# Altium project NFC-Reader.PrjPcb (part 5 of 11)
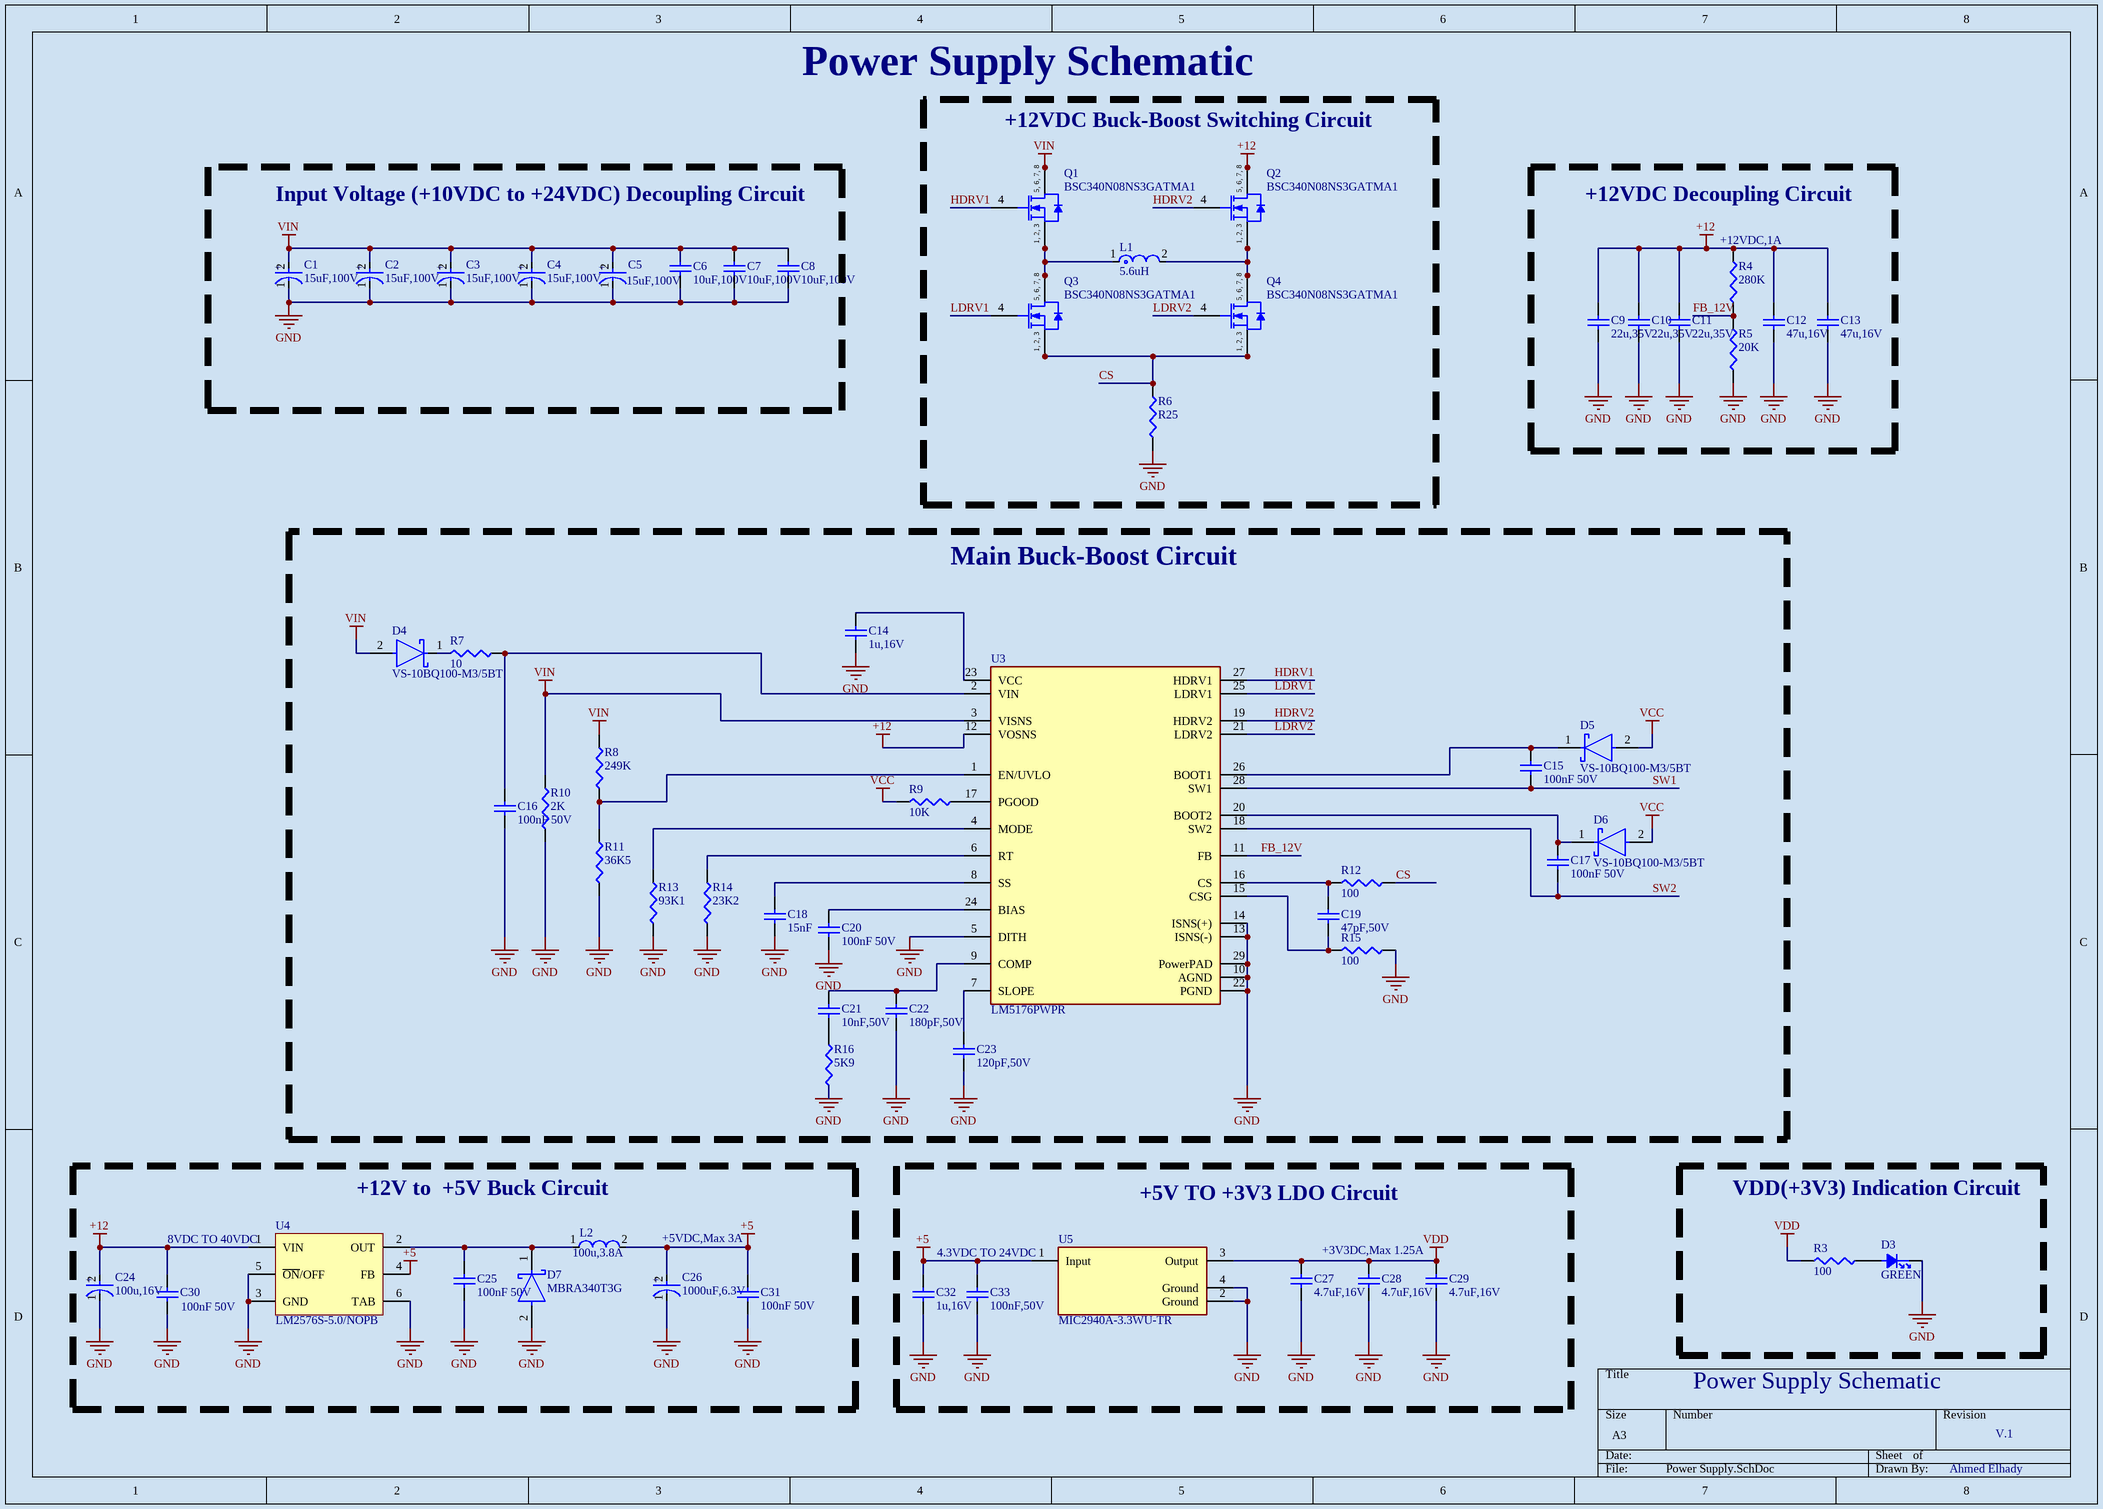
[diagram p8: Power Supply.SchDoc]

## Sheet Power Supply.SchDoc (continued)

### Library data of the parts (continued)
R14 = CRCW040223K2FKED: 23.2 kOhms ±1% 0.063W, 1/16W Chip Resistor 0402 (1005 Metric) Automotive AEC-Q200 Thick Film; Manufacturer: Vishay; Max Power Dissipation: 63mW; Value: 23.2kΩ; Temperature Coefficient: 100ppm/°C; Voltage Rating: 50V; Supplier: DigiKey; Manufacturer Part Number: CRCW040223K2FKED; RoHS: Compliant; Category: Chip SMD Resistors; Stock: 48935; Pricing: 1=0.1, 10=0.03, 25=0.0224, 50=0.018, 100=0.0148, 250=0.01156, 500=0.00974, 1000=0.00832, 5000=0.00637, 10000=0.00438, 20000=0.00433, 30000=0.0043, 50000=0.00427, 70000=0.00425, 100000=0.00414, 120000=0.00407, 240000=0.00384, 250000=0.00383 (USD); Case/Package: 0402; Case Code (Imperial): 0402; China RoHS: Non-Compliant; Composition: Thick Film; Contact Plating: Tin; Depth: 500µm; Features: Automotive AEC-Q200; Height: 350µm; Lead Free: Lead Free; Length: 1mm; Lifecycle Status: Production; Max Operating Temperature: 155°C; Military Standard: Not; Min Operating Temperature: -55°C; Mounting Technology: Surface Mount; Pins: 2; Number of Terminals: 2; Number of Terminations: 2; Packaging: Cut Tape; Power Dissipation: 63mW; Power Rating: 63mW; Radiation Hardening: No; REACH SVHC: Yes; Schedule B: 8533210045; Termination: SMD/SMT; Tolerance: 1%; Voltage Rating (DC): 50V; Weight: 652.039032µg; Width: 500µm; Working Voltage: 50V; ComponentLink1URL: https://datasheet.octopart.com:443/CRCW040223K2FKED-Vishay-datasheet-175423584.pdf?src-supplier=IHS; ComponentLink1Description: https://datasheet.octopart.com:443/CRCW040223K2FKED-Vishay-datasheet-175423584.pdf?src-supplier=IHS; ComponentLink2URL: https://datasheet.octopart.com:443/CRCW040223K2FKED-Vishay-datasheet-190005712.pdf?src-supplier=TME; ComponentLink2Description: https://datasheet.octopart.com:443/CRCW040223K2FKED-Vishay-datasheet-190005712.pdf?src-supplier=TME; ComponentLink3URL: https://datasheet.octopart.com:443/CRCW040223K2FKED.-Vishay-datasheet-83961561.pdf?src-supplier=element14+APAC; ComponentLink3Description: https://datasheet.octopart.com:443/CRCW040223K2FKED.-Vishay-datasheet-83961561.pdf?src-supplier=element14+APAC; ComponentLink4URL: https://datasheet.octopart.com:443/CRCW040223K2FKED-Vishay-datasheet-66077789.pdf?src-supplier=element14+APAC; ComponentLink4Description: https://datasheet.octopart.com:443/CRCW040223K2FKED-Vishay-datasheet-66077789.pdf?src-supplier=element14+APAC; ComponentLink5URL: https://datasheet.octopart.com:443/CRCW040223K2FKED-Vishay-datasheet-62317933.pdf?src-supplier=element14+APAC; ComponentLink5Description: https://datasheet.octopart.com:443/CRCW040223K2FKED-Vishay-datasheet-62317933.pdf?src-supplier=element14+APAC; ComponentLink6URL: https://datasheet.octopart.com:443/CRCW040223K2FKED-Vishay-datasheet-14722531.pdf?src-supplier=element14+APAC; ComponentLink6Description: https://datasheet.octopart.com:443/CRCW040223K2FKED-Vishay-datasheet-14722531.pdf?src-supplier=element14+APAC; ComponentLink7URL: https://datasheet.octopart.com:443/CRCW040223K2FKED.-Vishay-datasheet-78776209.pdf?src-supplier=Newark; ComponentLink7Description: https://datasheet.octopart.com:443/CRCW040223K2FKED.-Vishay-datasheet-78776209.pdf?src-supplier=Newark; ComponentLink8URL: https://datasheet.octopart.com:443/CRCW040223K2FKED-Vishay-datasheet-11761042.pdf?src-supplier=Newark; ComponentLink8Description: https://datasheet.octopart.com:443/CRCW040223K2FKED-Vishay-datasheet-11761042.pdf?src-supplier=Newark; ComponentLink9URL: https://datasheet.octopart.com:443/CRCW040223K2FKED-Vishay-datasheet-159614168.pdf?src-supplier=Newark; ComponentLink9Description: https://datasheet.octopart.com:443/CRCW040223K2FKED-Vishay-datasheet-159614168.pdf?src-supplier=Newark; ComponentLink10URL: https://datasheet.octopart.com:443/CRCW040223K2FKED-Vishay-datasheet-33013972.pdf?src-supplier=Newark; ComponentLink10Description: https://datasheet.octopart.com:443/CRCW040223K2FKED-Vishay-datasheet-33013972.pdf?src-supplier=Newark; ComponentLink11URL: https://datasheet.octopart.com:443/CRCW040223K2FKED-Vishay-datasheet-21268114.pdf?src-supplier=Newark; ComponentLink11Description: https://datasheet.octopart.com:443/CRCW040223K2FKED-Vishay-datasheet-21268114.pdf?src-supplier=Newark; ComponentLink12URL: https://datasheet.octopart.com:443/CRCW040223K2FKED-Vishay-datasheet-21226360.pdf?src-supplier=Newark; ComponentLink12Description: https://datasheet.octopart.com:443/CRCW040223K2FKED-Vishay-datasheet-21226360.pdf?src-supplier=Newark; ComponentLink13URL: https://datasheet.octopart.com:443/CRCW040223K2FKED-Vishay-datasheet-62316122.pdf?src-supplier=Future+Electronics; ComponentLink13Description: https://datasheet.octopart.com:443/CRCW040223K2FKED-Vishay-datasheet-62316122.pdf?src-supplier=Future+Electronics; ComponentLink14URL: https://datasheet.octopart.com:443/CRCW040223K2FKED-Vishay-datasheet-12509741.pdf?src-supplier=Future+Electronics; ComponentLink14Description: https://datasheet.octopart.com:443/CRCW040223K2FKED-Vishay-datasheet-12509741.pdf?src-supplier=Future+Electronics; ComponentLink15URL: https://datasheet.octopart.com:443/CRCW040223K2FKED-Vishay-Dale-datasheet-47688880.pdf?src-supplier=RS+(Formerly+Allied+Electronics); ComponentLink15Description: https://datasheet.octopart.com:443/CRCW040223K2FKED-Vishay-Dale-datasheet-47688880.pdf?src-supplier=RS+(Formerly+Allied+Electronics); ComponentLink16URL: https://datasheet.octopart.com:443/CRCW040223K2FKED-Vishay-datasheet-12001583.pdf?src-supplier=RS+(Formerly+Allied+Electronics); ComponentLink16Description: https://datasheet.octopart.com:443/CRCW040223K2FKED-Vishay-datasheet-12001583.pdf?src-supplier=RS+(Formerly+Allied+Electronics); ComponentLink17URL: https://datasheet.octopart.com:443/CRCW040223K2FKED-Vishay-datasheet-5306405.pdf?src-supplier=RS+(Formerly+Allied+Electronics); ComponentLink17Description: https://datasheet.octopart.com:443/CRCW040223K2FKED-Vishay-datasheet-5306405.pdf?src-supplier=RS+(Formerly+Allied+Electronics); ComponentLink18URL: https://datasheet.octopart.com/D-CRCW-e3-Standard-Thick-Film-Chip-Resistors-Vishay-datasheet-family-64.pdf; ComponentLink18Description: https://datasheet.octopart.com/D-CRCW-e3-Standard-Thick-Film-Chip-Resistors-Vishay-datasheet-family-64.pdf; ComponentLink19URL: https://datasheet.octopart.com:443/CRCW040223K2FKED-Vishay-datasheet-11516975.pdf?src-supplier=Farnell; ComponentLink19Description: https://datasheet.octopart.com:443/CRCW040223K2FKED-Vishay-datasheet-11516975.pdf?src-supplier=Farnell; ComponentLink20URL: https://datasheet.octopart.com:443/CRCW040223K2FKED-Vishay-datasheet-512477.pdf?src-supplier=Farnell; ComponentLink20Description: https://datasheet.octopart.com:443/CRCW040223K2FKED-Vishay-datasheet-512477.pdf?src-supplier=Farnell; ComponentLink21URL: https://datasheet.octopart.com:443/CRCW040223K2FKED-Vishay-datasheet-11540273.pdf?src-supplier=Arrow+Electronics; ComponentLink21Description: https://datasheet.octopart.com:443/CRCW040223K2FKED-Vishay-datasheet-11540273.pdf?src-supplier=Arrow+Electronics; ComponentLink22URL: https://datasheet.octopart.com:443/CRCW040223K2FKED-Vishay-datasheet-8445837.pdf?src-supplier=element14; ComponentLink22Description: https://datasheet.octopart.com:443/CRCW040223K2FKED-Vishay-datasheet-8445837.pdf?src-supplier=element14; ComponentLink23URL: https://datasheet.octopart.com:443/CRCW040223K2FKED-Vishay-datasheet-5377255.pdf?src-supplier=Garrett; ComponentLink23Description: https://datasheet.octopart.com:443/CRCW040223K2FKED-Vishay-datasheet-5377255.pdf?src-supplier=Garrett; ComponentLink24URL: https://datasheet.octopart.com:443/CRCW040223K2FKED-Vishay-datasheet-148188.pdf?src-supplier=Garrett; ComponentLink24Description: https://datasheet.octopart.com:443/CRCW040223K2FKED-Vishay-datasheet-148188.pdf?src-supplier=Garrett; ComponentLink25URL: https://datasheet.octopart.com:443/CRCW040223K2FKED-Vishay-datasheet-42367.pdf?src-supplier=Garrett; ComponentLink25Description: https://datasheet.octopart.com:443/CRCW040223K2FKED-Vishay-datasheet-42367.pdf?src-supplier=Garrett; ComponentLink26URL: http://sigma.octopart.com:80/rohs_certificate/D-CRCW-e3-Standard-Thick-Film-Chip-Resistors-Vishay-family-102.pdf?src-supplier=Compliance+Statements; ComponentLink26Description: http://sigma.octopart.com:80/rohs_certificate/D-CRCW-e3-Standard-Thick-Film-Chip-Resistors-Vishay-family-102.pdf?src-supplier=Compliance+Statements; LCSC PN: C2076557
R16 = CRCW04025K90FKED: 5.9 kOhms ±1% 0.063W, 1/16W Chip Resistor 0402 (1005 Metric) Automotive AEC-Q200 Thick Film; Manufacturer: Vishay; Max Power Dissipation: 63mW; Value: 5.9kΩ; Temperature Coefficient: 100ppm/°C; Voltage Rating: 50V; Supplier: DigiKey; Manufacturer Part Number: CRCW04025K90FKED; RoHS: Compliant; Category: Chip SMD Resistors; Stock: 139555; Pricing: 1=0.1, 10=0.03, 25=0.0224, 50=0.018, 100=0.0148, 250=0.01156, 500=0.00974, 1000=0.00832, 5000=0.00637 (USD); Case/Package: 0402; Case Code (Imperial): 0402; China RoHS: Non-Compliant; Composition: Thick Film; Contact Plating: Tin; Depth: 500µm; Features: Automotive AEC-Q200; Height: 350µm; Lead Free: Lead Free; Length: 1mm; Lifecycle Status: Production; Max Operating Temperature: 155°C; Military Standard: Not; Min Operating Temperature: -55°C; Mounting Technology: Surface Mount; Pins: 2; Number of Terminals: 2; Number of Terminations: 2; Packaging: Cut Tape; Power Dissipation: 63mW; Power Rating: 63mW; Radiation Hardening: No; REACH SVHC: Yes; Schedule B: 8533210045; Termination: SMD/SMT; Tolerance: 1%; Voltage Rating (DC): 50V; Weight: 652.039032µg; Width: 500µm; Working Voltage: 50V; ComponentLink1URL: https://datasheet.octopart.com:443/CRCW04025K90FKED-Vishay-datasheet-175423584.pdf?src-supplier=IHS; ComponentLink1Description: https://datasheet.octopart.com:443/CRCW04025K90FKED-Vishay-datasheet-175423584.pdf?src-supplier=IHS; ComponentLink2URL: https://datasheet.octopart.com:443/CRCW04025K90FKED-Vishay-datasheet-190005712.pdf?src-supplier=TME; ComponentLink2Description: https://datasheet.octopart.com:443/CRCW04025K90FKED-Vishay-datasheet-190005712.pdf?src-supplier=TME; ComponentLink3URL: https://datasheet.octopart.com:443/CRCW04025K90FKED-Vishay-datasheet-66077789.pdf?src-supplier=Newark; ComponentLink3Description: https://datasheet.octopart.com:443/CRCW04025K90FKED-Vishay-datasheet-66077789.pdf?src-supplier=Newark; ComponentLink4URL: https://datasheet.octopart.com:443/CRCW04025K90FKED-Vishay-datasheet-11761042.pdf?src-supplier=Newark; ComponentLink4Description: https://datasheet.octopart.com:443/CRCW04025K90FKED-Vishay-datasheet-11761042.pdf?src-supplier=Newark; ComponentLink5URL: https://datasheet.octopart.com:443/CRCW04025K90FKED-Vishay-datasheet-41302739.pdf?src-supplier=Newark; ComponentLink5Description: https://datasheet.octopart.com:443/CRCW04025K90FKED-Vishay-datasheet-41302739.pdf?src-supplier=Newark; ComponentLink6URL: https://datasheet.octopart.com:443/CRCW04025K90FKED-Vishay-datasheet-33013972.pdf?src-supplier=Newark; ComponentLink6Description: https://datasheet.octopart.com:443/CRCW04025K90FKED-Vishay-datasheet-33013972.pdf?src-supplier=Newark; ComponentLink7URL: https://datasheet.octopart.com:443/CRCW04025K90FKED-Vishay-datasheet-21226360.pdf?src-supplier=Newark; ComponentLink7Description: https://datasheet.octopart.com:443/CRCW04025K90FKED-Vishay-datasheet-21226360.pdf?src-supplier=Newark; ComponentLink8URL: https://datasheet.octopart.com:443/CRCW04025K90FKED-Vishay-datasheet-62317933.pdf?src-supplier=Farnell; ComponentLink8Description: https://datasheet.octopart.com:443/CRCW04025K90FKED-Vishay-datasheet-62317933.pdf?src-supplier=Farnell; ComponentLink9URL: https://datasheet.octopart.com:443/CRCW04025K90FKED.-Vishay-datasheet-83961561.pdf?src-supplier=Farnell; ComponentLink9Description: https://datasheet.octopart.com:443/CRCW04025K90FKED.-Vishay-datasheet-83961561.pdf?src-supplier=Farnell; ComponentLink10URL: https://datasheet.octopart.com:443/CRCW04025K90FKED-Vishay-datasheet-11516975.pdf?src-supplier=Farnell; ComponentLink10Description: https://datasheet.octopart.com:443/CRCW04025K90FKED-Vishay-datasheet-11516975.pdf?src-supplier=Farnell; ComponentLink11URL: https://datasheet.octopart.com:443/CRCW04025K90FKED-Vishay-datasheet-14722531.pdf?src-supplier=element14+APAC; ComponentLink11Description: https://datasheet.octopart.com:443/CRCW04025K90FKED-Vishay-datasheet-14722531.pdf?src-supplier=element14+APAC; ComponentLink12URL: https://datasheet.octopart.com:443/CRCW04025K90FKED-Vishay-datasheet-5299586.pdf?src-supplier=element14+APAC; ComponentLink12Description: https://datasheet.octopart.com:443/CRCW04025K90FKED-Vishay-datasheet-5299586.pdf?src-supplier=element14+APAC; ComponentLink13URL: https://datasheet.octopart.com:443/CRCW04025K90FKED-Vishay-datasheet-10380026.pdf?src-supplier=element14+APAC; ComponentLink13Description: https://datasheet.octopart.com:443/CRCW04025K90FKED-Vishay-datasheet-10380026.pdf?src-supplier=element14+APAC; ComponentLink14URL: https://datasheet.octopart.com:443/CRCW04025K90FKED-Vishay-datasheet-62316122.pdf?src-supplier=Future+Electronics; ComponentLink14Description: https://datasheet.octopart.com:443/CRCW04025K90FKED-Vishay-datasheet-62316122.pdf?src-supplier=Future+Electronics; ComponentLink15URL: https://datasheet.octopart.com:443/CRCW04025K90FKED-Vishay-datasheet-12519820.pdf?src-supplier=Future+Electronics; ComponentLink15Description: https://datasheet.octopart.com:443/CRCW04025K90FKED-Vishay-datasheet-12519820.pdf?src-supplier=Future+Electronics; ComponentLink16URL: https://datasheet.octopart.com:443/CRCW04025K90FKED-Vishay-Dale-datasheet-47688880.pdf?src-supplier=RS+(Formerly+Allied+Electronics); ComponentLink16Description: https://datasheet.octopart.com:443/CRCW04025K90FKED-Vishay-Dale-datasheet-47688880.pdf?src-supplier=RS+(Formerly+Allied+Electronics); ComponentLink17URL: https://datasheet.octopart.com:443/CRCW04025K90FKED-Vishay-datasheet-12001583.pdf?src-supplier=RS+(Formerly+Allied+Electronics); ComponentLink17Description: https://datasheet.octopart.com:443/CRCW04025K90FKED-Vishay-datasheet-12001583.pdf?src-supplier=RS+(Formerly+Allied+Electronics); ComponentLink18URL: https://datasheet.octopart.com:443/CRCW04025K90FKED-Vishay-datasheet-5306405.pdf?src-supplier=RS+(Formerly+Allied+Electronics); ComponentLink18Description: https://datasheet.octopart.com:443/CRCW04025K90FKED-Vishay-datasheet-5306405.pdf?src-supplier=RS+(Formerly+Allied+Electronics); ComponentLink19URL: https://datasheet.octopart.com/D-CRCW-e3-Standard-Thick-Film-Chip-Resistors-Vishay-datasheet-family-64.pdf; ComponentLink19Description: https://datasheet.octopart.com/D-CRCW-e3-Standard-Thick-Film-Chip-Resistors-Vishay-datasheet-family-64.pdf; ComponentLink20URL: https://datasheet.octopart.com:443/CRCW04025K90FKED-Vishay-datasheet-8445837.pdf?src-supplier=element14; ComponentLink20Description: https://datasheet.octopart.com:443/CRCW04025K90FKED-Vishay-datasheet-8445837.pdf?src-supplier=element14; ComponentLink21URL: https://datasheet.octopart.com:443/CRCW04025K90FKED-Vishay-datasheet-5377255.pdf?src-supplier=Garrett; ComponentLink21Description: https://datasheet.octopart.com:443/CRCW04025K90FKED-Vishay-datasheet-5377255.pdf?src-supplier=Garrett; ComponentLink22URL: https://datasheet.octopart.com:443/CRCW04025K90FKED-Vishay-datasheet-148188.pdf?src-supplier=Garrett; ComponentLink22Description: https://datasheet.octopart.com:443/CRCW04025K90FKED-Vishay-datasheet-148188.pdf?src-supplier=Garrett; ComponentLink23URL: https://datasheet.octopart.com:443/CRCW04025K90FKED-Vishay-datasheet-42367.pdf?src-supplier=Garrett; ComponentLink23Description: https://datasheet.octopart.com:443/CRCW04025K90FKED-Vishay-datasheet-42367.pdf?src-supplier=Garrett; ComponentLink24URL: http://sigma.octopart.com:80/rohs_certificate/D-CRCW-e3-Standard-Thick-Film-Chip-Resistors-Vishay-family-102.pdf?src-supplier=Compliance+Statements; ComponentLink24Description: http://sigma.octopart.com:80/rohs_certificate/D-CRCW-e3-Standard-Thick-Film-Chip-Resistors-Vishay-family-102.pdf?src-supplier=Compliance+Statements; LCSC PN: C2085399
U3 = LM5176PWPR: Buck-Boost Regulator Positive Output Step-Up/Step-Down DC-DC Controller IC 28-HTSSOP; Manufacturer: Texas Instruments; Manufacturer Lifecycle Status: ACTIVE; Supplier: DigiKey; Manufacturer Part Number: LM5176PWPR; RoHS: Compliant; Category: Integrated Circuits (ICs); Stock: 2903; Pricing: 1=7.76, 10=6.004, 25=5.5644, 100=5.0815, 250=4.85124, 500=4.71244, 1000=4.59822 (USD); Height: 1.2mm; Length: 9.7mm; Lifecycle Status: Production; Max Operating Temperature: 125°C; Min Operating Temperature: -40°C; Pins: 28; Schedule B: 8542390000, 8542390000|8542390000|8542390000|8542390000|8542390000; Thickness: 1mm; Topology: Buck-Boost; Width: 4.4mm; ComponentLink1URL: https://sigma.octopart.com:443/149651771/technical_drawing/Texas-Instruments-LM5176PWPR.pdf?src-supplier=Texas+Instruments; ComponentLink1Description: https://sigma.octopart.com:443/149651771/technical_drawing/Texas-Instruments-LM5176PWPR.pdf?src-supplier=Texas+Instruments; ComponentLink2URL: https://octopart.com:443/opatz8j6/c1?t=vc9joNWpwikMECXl6jF3E6Rz0PZzyxJ3n3avslgP6iGH_Pm5K3HR4EsbWHcWcqIwfDGu90-AGlzUONDyCsw9SQjo38uZJTNl_w7gbkiBgEYgQyjwYYxXEhyIccZGENrah1CXUA36_ziZ7gkexytO-K5vyI9DK7METPvHxjBHvmNi7OG2pls60FX5nxWavgVQIbahnLozQoMaI7COdlCCGP_rK5NhxD3Zcy536ewMOB-0ew3sExV3JOwhmLFHLLPgOPFcGktcdZRW_oquGXAgjDjlXW9igv-y-SbO22o8f6JpQ7Y9bUyjZdLcKuJKpBPJ_JZEwxLu5Gu4m0ryBmHhYRwT4KNP0P55HakqvFZvEL0VRet7s9h1vAUAT8aDmYu6rw4H&src-supplier=Texas+Instruments; ComponentLink2Description: https://octopart.com:443/opatz8j6/c1?t=vc9joNWpwikMECXl6jF3E6Rz0PZzyxJ3n3avslgP6iGH_Pm5K3HR4EsbWHcWcqIwfDGu90-AGlzUONDyCsw9SQjo38uZJTNl_w7gbkiBgEYgQyjwYYxXEhyIccZGENrah1CXUA36_ziZ7gkexytO-K5vyI9DK7METPvHxjBHvmNi7OG2pls60FX5nxWavgVQIbahnLozQoMaI7COdlCCGP_rK5NhxD3Zcy536ewMOB-0ew3sExV3JOwhmLFHLLPgOPFcGktcdZRW_oquGXAgjDjlXW9igv-y-SbO22o8f6JpQ7Y9bUyjZdLcKuJKpBPJ_JZEwxLu5Gu4m0ryBmHhYRwT4KNP0P55HakqvFZvEL0VRet7s9h1vAUAT8aDmYu6rw4H&src-supplier=Texas+Instruments; ComponentLink3URL: https://sigma.octopart.com:443/49250896/technical_drawing/Texas-Instruments-LM5176PWPR.pdf?src-supplier=Texas+Instruments; ComponentLink3Description: https://sigma.octopart.com:443/49250896/technical_drawing/Texas-Instruments-LM5176PWPR.pdf?src-supplier=Texas+Instruments; ComponentLink4URL: http://sigma.octopart.com:80/conflict_mineral_statement/Texas-Instruments-company-63.pdf?src-supplier=Compliance+Statements; ComponentLink4Description: http://sigma.octopart.com:80/conflict_mineral_statement/Texas-Instruments-company-63.pdf?src-supplier=Compliance+Statements; ComponentLink5URL: http://sigma.octopart.com:80/reach_statement/Texas-Instruments-company-64.pdf?src-supplier=Compliance+Statements; ComponentLink5Description: http://sigma.octopart.com:80/reach_statement/Texas-Instruments-company-64.pdf?src-supplier=Compliance+Statements; LCSC PN: C442493
U4 = LM2576S-5.0/NOPB: Buck Switching Regulator IC Positive Fixed 5V 1 Output 3A TO-263-6, D2PAK (5 Leads + Tab), TO-263BA; Manufacturer: Texas Instruments; Manufacturer Lifecycle Status: ACTIVE; Efficiency: 77%; Frequency: 52kHz; Max Supply Voltage: 40V; Min Input Voltage: 4V; Number of Channels: 1; Quiescent Current: 5mA; Switching Frequency: 58kHz; Supplier: DigiKey; Manufacturer Part Number: LM2576S-5.0/NOPB; RoHS: Compliant; Category: Voltage Regulators - Switching; Stock: 2580; Pricing: 1=4.48, 10=3.404, 45=2.99378, 135=2.78644, 270=2.68493, 540=2.60139, 1035=2.53646, 2520=2.46488 (USD); Case/Package: TO-263; Contact Plating: Tin; Height: 4.83mm; Length: 10.16mm; Lifecycle Status: Production; Max Operating Temperature: 125°C; Max Output current: 3A; Max Output Voltage: 5V; Min Operating Temperature: -40°C; Min Supply Voltage: 4V; Mounting Technology: Surface Mount; Nominal Output Voltage: 5V; Number of Outputs: 1; Pins: 5; Output Current: 3A; Output Type: Fixed; Output Voltage: 5V; Radiation Hardening: No; REACH SVHC: No; Schedule B: 8542390000, 8542390000|8542390000, 8542390000|8542390000|8542390000, 8542390000|8542390000|8542390000|8542390000; Termination: SMD/SMT; Thickness: 4.58mm; Topology: Buck; Weight: 113.398093g; Width: 8.42mm; ComponentLink1URL: https://datasheet.octopart.com:443/LM2576S-5.0-NOPB-Texas-Instruments-datasheet-31978431.pdf?src-supplier=Texas+Instruments; ComponentLink1Description: https://datasheet.octopart.com:443/LM2576S-5.0-NOPB-Texas-Instruments-datasheet-31978431.pdf?src-supplier=Texas+Instruments; ComponentLink2URL: https://octopart.com:443/opatz8j6/c1?t=vTLdpRcAlzxwQmwqkV-g5MTzL91FKiO8YCI-dhDlBjpFOXpoGPAkGRLiTPFv47FK8lYGfcXnum07RhFvMeg1HOGeo0LtdumxMxlN-xIkQw_vfXVzXGM0akenp6bKSTQFj1ZNusz68omFsyoOEm7g8d48LyM-SBkJ450NokXq2LiP3OuQAUCWRcJ0fwOEKd-FiuQnLDD6_BmQm3RvgjH20xeAZz2rgyw7lq3YoxOYrDy4xa6ZrBdDRdlCT8mEW5r_sEj2UZ1aF5CWxKLh0_vzSqei1yh5VZFFU7dwVtAbvRRfzdO2kJX0aQP-zxD6PSGdgU1GpBbMbKmIB9_ozpNjtvVts8IHig-UoyxZFed4aLsETwF_D_Fqylvb_4qKpcoF7BDWuA&src-supplier=Texas+Instruments; ComponentLink2Description: https://octopart.com:443/opatz8j6/c1?t=vTLdpRcAlzxwQmwqkV-g5MTzL91FKiO8YCI-dhDlBjpFOXpoGPAkGRLiTPFv47FK8lYGfcXnum07RhFvMeg1HOGeo0LtdumxMxlN-xIkQw_vfXVzXGM0akenp6bKSTQFj1ZNusz68omFsyoOEm7g8d48LyM-SBkJ450NokXq2LiP3OuQAUCWRcJ0fwOEKd-FiuQnLDD6_BmQm3RvgjH20xeAZz2rgyw7lq3YoxOYrDy4xa6ZrBdDRdlCT8mEW5r_sEj2UZ1aF5CWxKLh0_vzSqei1yh5VZFFU7dwVtAbvRRfzdO2kJX0aQP-zxD6PSGdgU1GpBbMbKmIB9_ozpNjtvVts8IHig-UoyxZFed4aLsETwF_D_Fqylvb_4qKpcoF7BDWuA&src-supplier=Texas+Instruments; ComponentLink3URL: https://sigma.octopart.com:443/49250911/technical_drawing/Texas-Instruments-LM2576S-5.0-NOPB.pdf?src-supplier=Texas+Instruments; ComponentLink3Description: https://sigma.octopart.com:443/49250911/technical_drawing/Texas-Instruments-LM2576S-5.0-NOPB.pdf?src-supplier=Texas+Instruments; ComponentLink4URL: https://datasheet.octopart.com:443/LM2576S-5.0-NOPB-Texas-Instruments-datasheet-14775416.pdf?src-supplier=Texas+Instruments; ComponentLink4Description: https://datasheet.octopart.com:443/LM2576S-5.0-NOPB-Texas-Instruments-datasheet-14775416.pdf?src-supplier=Texas+Instruments; ComponentLink5URL: https://datasheet.octopart.com:443/LM2576S-5.0/NOPB-Texas-Instruments-datasheet-13482831.pdf?src-supplier=Texas+Instruments; ComponentLink5Description: https://datasheet.octopart.com:443/LM2576S-5.0/NOPB-Texas-Instruments-datasheet-13482831.pdf?src-supplier=Texas+Instruments; ComponentLink6URL: https://datasheet.octopart.com:443/LM2576S-5.0/NOPB-Texas-Instruments-datasheet-10618141.pdf?src-supplier=element14; ComponentLink6Description: https://datasheet.octopart.com:443/LM2576S-5.0/NOPB-Texas-Instruments-datasheet-10618141.pdf?src-supplier=element14; ComponentLink7URL: https://datasheet.octopart.com:443/LM2576S-5.0-NOPB-Texas-Instruments-datasheet-2713.pdf?src-supplier=element14; ComponentLink7Description: https://datasheet.octopart.com:443/LM2576S-5.0-NOPB-Texas-Instruments-datasheet-2713.pdf?src-supplier=element14; ComponentLink8URL: https://datasheet.octopart.com:443/LM2576S-5.0-NOPB-Texas-Instruments-datasheet-21076658.pdf?src-supplier=Newark; ComponentLink8Description: https://datasheet.octopart.com:443/LM2576S-5.0-NOPB-Texas-Instruments-datasheet-21076658.pdf?src-supplier=Newark; ComponentLink9URL: https://datasheet.octopart.com:443/LM2576S-5.0-NOPB-Texas-Instruments-datasheet-58101102.pdf?src-supplier=Newark; ComponentLink9Description: https://datasheet.octopart.com:443/LM2576S-5.0-NOPB-Texas-Instruments-datasheet-58101102.pdf?src-supplier=Newark; ComponentLink10URL: https://datasheet.octopart.com:443/LM2576S-5.0-NOPB-Texas-Instruments-datasheet-21076659.pdf?src-supplier=Farnell; ComponentLink10Description: https://datasheet.octopart.com:443/LM2576S-5.0-NOPB-Texas-Instruments-datasheet-21076659.pdf?src-supplier=Farnell; ComponentLink11URL: https://datasheet.octopart.com:443/LM2576S-5.0-NOPB-Texas-Instruments-datasheet-14720404.pdf?src-supplier=Farnell; ComponentLink11Description: https://datasheet.octopart.com:443/LM2576S-5.0-NOPB-Texas-Instruments-datasheet-14720404.pdf?src-supplier=Farnell; ComponentLink12URL: https://datasheet.octopart.com:443/LM2576S-5.0-NOPB-Texas-Instruments-datasheet-164397537.pdf?src-supplier=LCSC; ComponentLink12Description: https://datasheet.octopart.com:443/LM2576S-5.0-NOPB-Texas-Instruments-datasheet-164397537.pdf?src-supplier=LCSC; ComponentLink13URL: https://datasheet.octopart.com:443/LM2576S-5.0-NOPB-Texas-Instruments-datasheet-159115115.pdf?src-supplier=LCSC; ComponentLink13Description: https://datasheet.octopart.com:443/LM2576S-5.0-NOPB-Texas-Instruments-datasheet-159115115.pdf?src-supplier=LCSC; ComponentLink14URL: https://datasheet.octopart.com:443/LM2576S-5.0-NOPB-Texas-Instruments-datasheet-96976008.pdf?src-supplier=TME; ComponentLink14Description: https://datasheet.octopart.com:443/LM2576S-5.0-NOPB-Texas-Instruments-datasheet-96976008.pdf?src-supplier=TME; ComponentLink15URL: https://datasheet.octopart.com:443/LM2576S-5.0-NOPB-Texas-Instruments-datasheet-49271545.pdf?src-supplier=element14+APAC; ComponentLink15Description: https://datasheet.octopart.com:443/LM2576S-5.0-NOPB-Texas-Instruments-datasheet-49271545.pdf?src-supplier=element14+APAC; ComponentLink16URL: https://datasheet.octopart.com:443/LM2576S-5.0/NOPB-National-Semiconductor-datasheet-9902084.pdf?src-supplier=RS+(Formerly+Allied+Electronics); ComponentLink16Description: https://datasheet.octopart.com:443/LM2576S-5.0/NOPB-National-Semiconductor-datasheet-9902084.pdf?src-supplier=RS+(Formerly+Allied+Electronics); ComponentLink17URL: https://datasheet.octopart.com:443/LM2576S-5.0-NOPB-Texas-Instruments-datasheet-8321813.pdf?src-supplier=Jameco; ComponentLink17Description: https://datasheet.octopart.com:443/LM2576S-5.0-NOPB-Texas-Instruments-datasheet-8321813.pdf?src-supplier=Jameco; ComponentLink18URL: http://sigma.octopart.com:80/conflict_mineral_statement/Texas-Instruments-company-63.pdf?src-supplier=Compliance+Statements; ComponentLink18Description: http://sigma.octopart.com:80/conflict_mineral_statement/Texas-Instruments-company-63.pdf?src-supplier=Compliance+Statements; ComponentLink19URL: http://sigma.octopart.com:80/reach_statement/Texas-Instruments-company-64.pdf?src-supplier=Compliance+Statements; ComponentLink19Description: http://sigma.octopart.com:80/reach_statement/Texas-Instruments-company-64.pdf?src-supplier=Compliance+Statements; LCSC PN: C880552
U5 = MIC2940A-3.3WU-TR: Linear Voltage Regulator IC Positive Fixed 1 Output 1.25A TO-263-3; Manufacturer: Microchip; Accuracy: 2.5%; Dropout Voltage: 400mV; Max Supply Voltage: 26V; Max Junction Temperature (Tj): 125°C; Min Input Voltage: 2V; Min Output Voltage: 3.3V; Min Supply Voltage: 3.7V; Number of Outputs: 1; Output Voltage Accuracy: 1%; Quiescent Current: 500µA; Supplier: DigiKey; Manufacturer Part Number: MIC2940A-3.3WU-TR; RoHS: Compliant; Category: LDO Voltage Regulators; Stock: 772; Pricing: 1=2.67, 25=2.23, 100=2.03, 750=2.03001 (USD); Projected EOL Date: 2034-05-14; Case/Package: TO-263-3; Country of Assembly: China; Country of Fabrication: United States of America; Country of Origin: China; Export Control Classification Number (ECCN) Code: EAR99; Height: 4.902mm; Harmonized Tariff Schedule (HTS) Code: 8542.39.0060; Lead Free: Lead Free; Lifecycle Status: Production; Max Operating Temperature: 125°C; Max Output current: 1.25A; Min Operating Temperature: -40°C; Mounting Technology: Surface Mount; Pins: 3; Number of Regulators: 1; Output Current: 1.25A; Output Voltage: 3.3V; Polarity: Positive; Radiation Hardening: No; Schedule B: 8542390000; ComponentLink1URL: https://datasheet.octopart.com:443/MIC2940A-3.3WU-TR-Microchip-datasheet-164493852.pdf?src-supplier=Upverter; ComponentLink1Description: https://datasheet.octopart.com:443/MIC2940A-3.3WU-TR-Microchip-datasheet-164493852.pdf?src-supplier=Upverter; ComponentLink2URL: https://datasheet.octopart.com:443/MIC2940A-3.3WU-TR-Microchip-datasheet-109479.pdf?src-supplier=SHENGYU+ELECTRONICS; ComponentLink2Description: https://datasheet.octopart.com:443/MIC2940A-3.3WU-TR-Microchip-datasheet-109479.pdf?src-supplier=SHENGYU+ELECTRONICS; ComponentLink3URL: https://datasheet.octopart.com:443/MIC2940A-3.3WU-TR-Microchip-datasheet-134530682.pdf?src-supplier=Geoflip; ComponentLink3Description: https://datasheet.octopart.com:443/MIC2940A-3.3WU-TR-Microchip-datasheet-134530682.pdf?src-supplier=Geoflip; ComponentLink4URL: https://datasheet.octopart.com:443/MIC2940A-3.3WUTR-Micrel-datasheet-14170148.pdf?src-supplier=iiiC; ComponentLink4Description: https://datasheet.octopart.com:443/MIC2940A-3.3WUTR-Micrel-datasheet-14170148.pdf?src-supplier=iiiC; ComponentLink5URL: http://sigma.octopart.com:80/188455473/materials_sheet/Microchip-MIC2940A-3.3WU-TR.pdf?src-supplier=Compliance+Statements; ComponentLink5Description: http://sigma.octopart.com:80/188455473/materials_sheet/Microchip-MIC2940A-3.3WU-TR.pdf?src-supplier=Compliance+Statements; ComponentLink6URL: http://sigma.octopart.com:80/conflict_mineral_statement/Microchip-company-68.pdf?src-supplier=Compliance+Statements; ComponentLink6Description: http://sigma.octopart.com:80/conflict_mineral_statement/Microchip-company-68.pdf?src-supplier=Compliance+Statements; ComponentLink7URL: http://sigma.octopart.com:80/conflict_mineral_statement/Microchip-company-69.pdf?src-supplier=Compliance+Statements; ComponentLink7Description: http://sigma.octopart.com:80/conflict_mineral_statement/Microchip-company-69.pdf?src-supplier=Compliance+Statements; ComponentLink8URL: http://sigma.octopart.com:80/reach_statement/Microchip-company-70.pdf?src-supplier=Compliance+Statements; ComponentLink8Description: http://sigma.octopart.com:80/reach_statement/Microchip-company-70.pdf?src-supplier=Compliance+Statements; ComponentLink9URL: http://sigma.octopart.com:80/rohs_statement/Microchip-company-71.pdf?src-supplier=Compliance+Statements; ComponentLink9Description: http://sigma.octopart.com:80/rohs_statement/Microchip-company-71.pdf?src-supplier=Compliance+Statements; LCSC PN: C632743

## Sheet ESP32-Main.SchDoc
size A; SheetNumber: 3; SheetTotal: 5
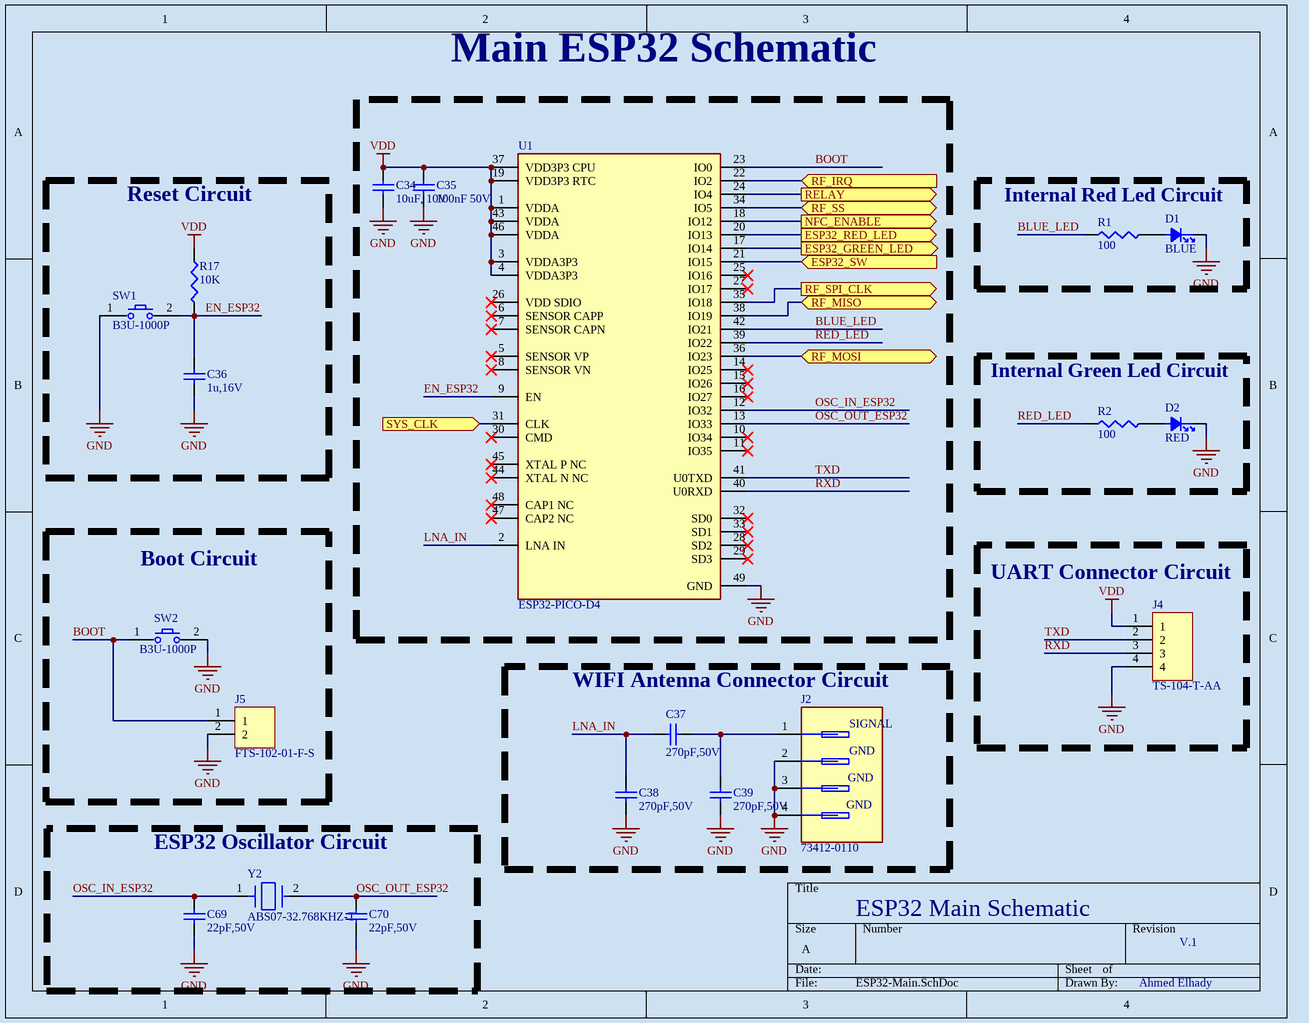
[diagram p2: ESP32-Main.SchDoc]

### Parts
C34  10uF, 10V  [CAPC1005X90N]
C35  100nF 50V  [0603 (1608 Metric)-CAP-100NF-50V]
C36  1u,16V  [0603 (1608 Metric)-CAP-100NF-50V]
C37  270pF,50V  [0402_470pF_50VMurata_GCM155-0_05_MFG]
C38  270pF,50V  [0402_470pF_50VMurata_GCM155-0_05_MFG]
C39  270pF,50V  [0402_470pF_50VMurata_GCM155-0_05_MFG]
C69  22pF,50V  [22Pf_50V_Kemet_C0603C220J5GACTU_0]
C70  22pF,50V  [22Pf_50V_Kemet_C0603C220J5GACTU_0]
D1  BLUE  [LED0402B]
D2  RED  [LED0402R]
J2  73412-0110  [ANT_CONN_Molex_734-12-0110_0]
J4  TS-104-T-AA  [4pins-SAMTEC_TS-104-T-AA]
J5  FTS-102-01-F-S  [HDR1X2_1.27MM]
R1  100  [0603-RES-10OHM-0.1W]
R2  100  [0603-RES-10OHM-0.1W]
R17  10K  [YAGEO-0603-10K-0.1W]
SW1  B3U-1000P  [SW_PUSHBOTTON_B3U-1000P]
SW2  B3U-1000P  [SW_PUSHBOTTON_B3U-1000P]
U1  ESP32-PICO-D4  [Espressif_Systems_0_IPC_B]
Y2  ABS07-32.768KHZ-T  [CRYSTAL_32.768kHZ_FPABS07-MFG]

### Blocks framed on the sheet
Reset Circuit: C36 R17 SW1
Internal Red Led Circuit: D1 R1
Internal Green Led Circuit: D2 R2
Boot Circuit: J5 SW2
UART Connector Circuit: J4
WIFI Antenna Connector Circuit: C37-C39 J2
ESP32 Oscillator Circuit: C69 C70 Y2

### Ports
ESP32_GREEN_LED (out, see Main Block Diagram[2C], Relay-Switch[2C]), ESP32_RED_LED (out, see Main Block Diagram[2C], Relay-Switch[2B]), ESP32_SW (in, see Main Block Diagram[2C], Relay-Switch[2C]), NFC_ENABLE (out, see Main Block Diagram[3C], RFID-Reader[2C]), RELAY (out, see Main Block Diagram[2C], Relay-Switch[1B]), RF_IRQ (in, see Main Block Diagram[3C], RFID-Reader[3C]), RF_MISO (bidir, see Main Block Diagram[3C], RFID-Reader[2D]), RF_MOSI (bidir, see Main Block Diagram[3C], RFID-Reader[2D]), RF_SPI_CLK (out, see Main Block Diagram[3C], RFID-Reader[3C]), RF_SS (bidir, see Main Block Diagram[3C], RFID-Reader[2C]), SYS_CLK (in, see Main Block Diagram[3C], RFID-Reader[3C])

### Nets
GND: C34.1 C35.1 C36.2 C38.1 C39.1 C69.1 C70.1 D1.1(Cathode) D2.1(Cathode) J2.2(GROUND) J2.3(GROUND) J2.4(GROUND) J4.4 J5.2 SW1.1 SW2.2 U1.49(GND)
VDD: C34.2 C35.2 J4.1 R17.2 U1.1(VDDA) U1.3(VDDA3P3) U1.4(VDDA3P3) U1.19(VDD3P3_RTC) U1.37(VDD3P3_CPU) U1.43(VDDA) U1.46(VDDA)
BLUE_LED: R1.1 U1.42(IO21)
BOOT: J5.1 SW2.1 U1.23(IO0)
EN_ESP32: C36.1 R17.1 SW1.2 U1.9(EN)
ESP32_GREEN_LED: U1.17(IO14) ; port ESP32_GREEN_LED
ESP32_RED_LED: U1.20(IO13) ; port ESP32_RED_LED
ESP32_SW: U1.21(IO15) ; port ESP32_SW
LNA_IN: C37.2 C38.2 U1.2(LNA_IN)
NFC_ENABLE: U1.18(IO12) ; port NFC_ENABLE
OSC_IN_ESP32: C69.2 U1.12(IO32) Y2.1
OSC_OUT_ESP32: C70.2 U1.13(IO33) Y2.2
RED_LED: R2.1 U1.39(IO22)
RELAY: U1.24(IO4) ; port RELAY
RF_IRQ: U1.22(IO2) ; port RF_IRQ
RF_MISO: U1.38(IO19) ; port RF_MISO
RF_MOSI: U1.36(IO23) ; port RF_MOSI
RF_SPI_CLK: U1.35(IO18) ; port RF_SPI_CLK
RF_SS: U1.34(IO5) ; port RF_SS
RXD: J4.3 U1.40(U0RXD)
SYS_CLK: U1.31(CLK) ; port SYS_CLK
TXD: J4.2 U1.41(U0TXD)
NetC37_1: C37.1 C39.2 J2.1(SIGNAL)
NetD1_2: D1.2(Anode) R1.2
NetD2_2: D2.2(Anode) R2.2

Not connected (* = marked no-connect by the designer): U1 5(SENSOR_VP)* 6(SENSOR_CAPP)* 7(SENSOR_CAPN)* 8(SENSOR_VN)* 10(IO34)* 11(IO35)* 14(IO25)* 15(IO26)* 16(IO27)* 25(IO16)* 26(VDD_SDIO)* 27(IO17)* 28(SD2)* 29(SD3)* 30(CMD)* 32(SD0)* 33(SD1)* 44(XTAL_N_NC)* 45(XTAL_P_NC)* 47(CAP2_NC)* 48(CAP1_NC)*

### Notes on the sheet
- Main ESP32 Schematic
- ESP32 Main Schematic
- V.1
- Ahmed Elhady
- (in symbol 73412-0110) GND